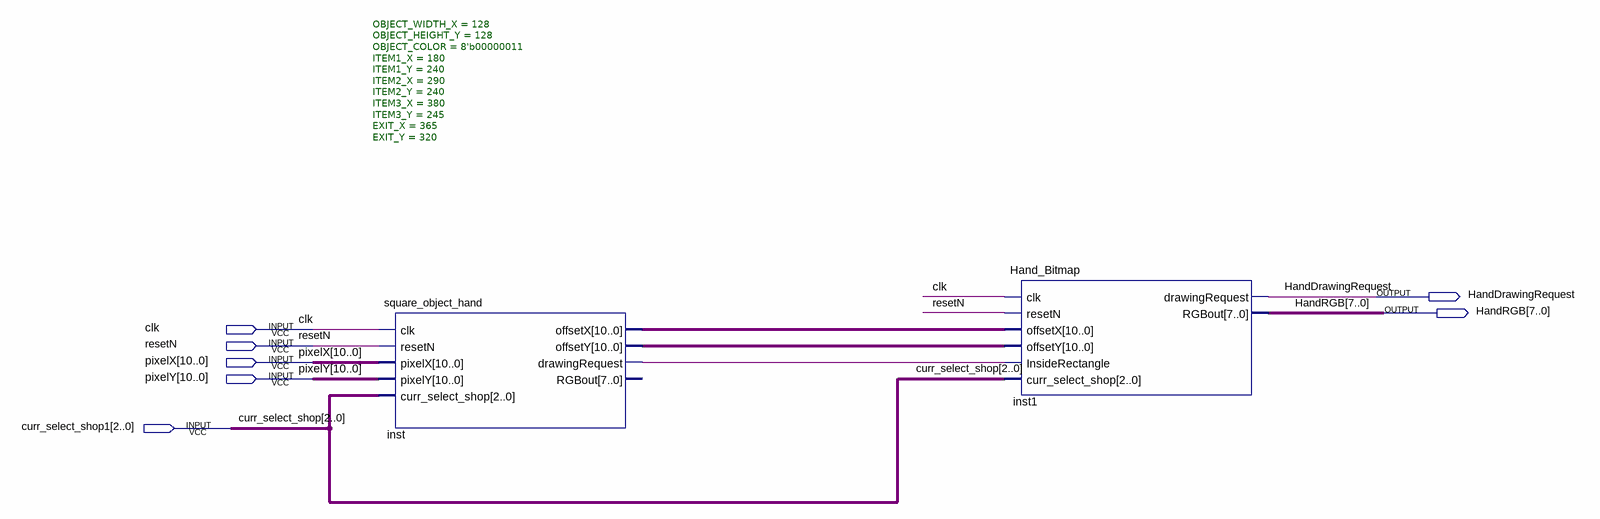
[diagram p0: schematic sheet]
// Quartus schematic Hand_Display.bdf as structural Verilog: 2 symbols, 7 pins
module Hand_Display (
  input  clk,
  input  resetN,
  input  [10:0] pixelX,
  input  [10:0] pixelY,
  input  [2:0] curr_select_shop1,
  output HandDrawingRequest,
  output [7:0] HandRGB
);

  wire inst_drawingrequest;
  wire [10:0] inst_offsetx, inst_offsety;

  square_object_hand #(.OBJECT_WIDTH_X(128), .OBJECT_HEIGHT_Y(128), .OBJECT_COLOR(8'b00000011), .ITEM1_X(180), .ITEM1_Y(240), .ITEM2_X(290), .ITEM2_Y(240), .ITEM3_X(380), .ITEM3_Y(245), .EXIT_X(365), .EXIT_Y(320)) inst (
    .clk(clk), .resetN(resetN), .pixelX(pixelX), .pixelY(pixelY), .curr_select_shop(curr_select_shop1),
    .offsetX(inst_offsetx), .offsetY(inst_offsety), .drawingRequest(inst_drawingrequest));  // open: RGBout
  Hand_Bitmap inst1 (
    .clk(clk), .resetN(resetN), .offsetX(inst_offsetx), .offsetY(inst_offsety),
    .InsideRectangle(inst_drawingrequest), .curr_select_shop(curr_select_shop1),
    .drawingRequest(HandDrawingRequest), .RGBout(HandRGB));

  // Other names for the same wires on the sheet: curr_select_shop[2:0] = curr_select_shop1
endmodule
